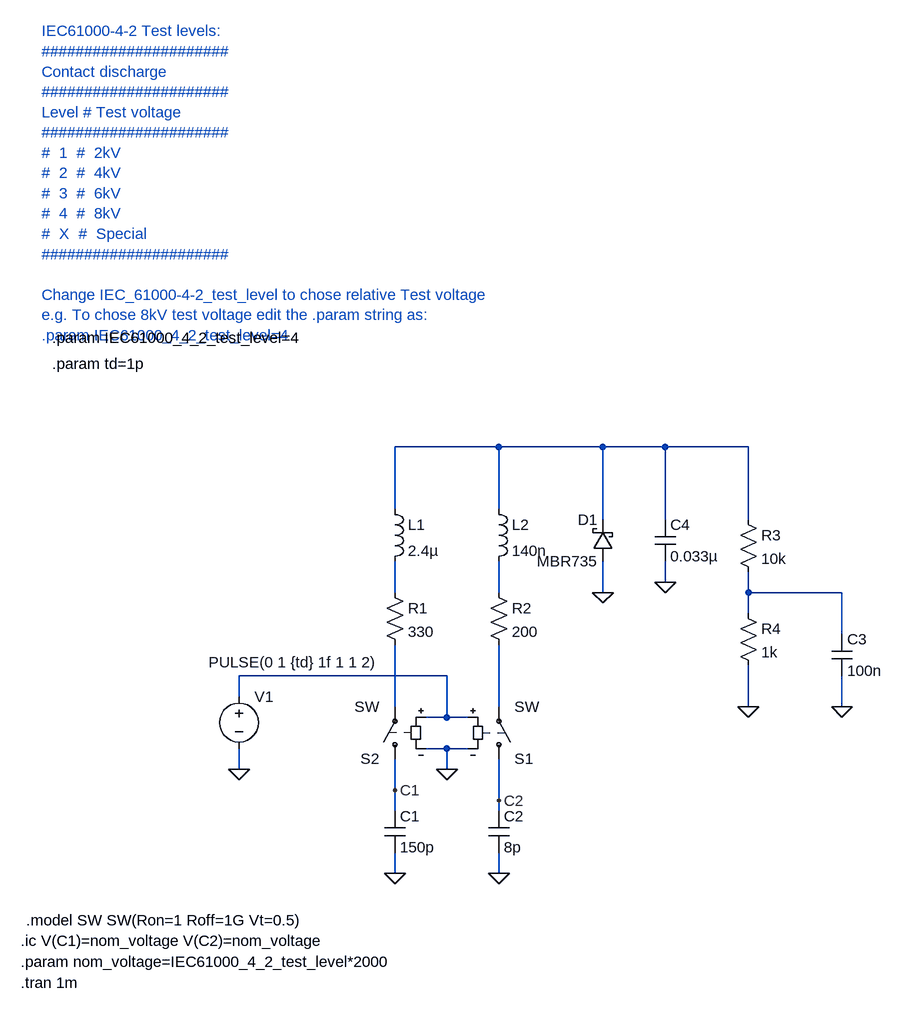
[diagram p0: schematic ISO61000-4-2.asc]
ISO61000-4-2.asc, the LTspice schematic file:
Version 4
SHEET 1 1932 840
WIRE 224 -16 64 -16
WIRE 384 -16 224 -16
WIRE 480 -16 384 -16
WIRE 608 -16 480 -16
WIRE 64 80 64 -16
WIRE 224 80 224 -16
WIRE 384 96 384 -16
WIRE 480 96 480 -16
WIRE 608 96 608 -16
WIRE 480 192 480 160
WIRE 64 208 64 160
WIRE 224 208 224 160
WIRE 384 208 384 160
WIRE 608 208 608 176
WIRE 752 208 608 208
WIRE 608 240 608 208
WIRE 752 272 752 208
WIRE 144 336 -176 336
WIRE -176 368 -176 336
WIRE 64 384 64 288
WIRE 224 384 224 288
WIRE 608 384 608 320
WIRE 752 384 752 336
WIRE 144 400 144 336
WIRE 144 400 112 400
WIRE 176 400 144 400
WIRE 144 448 112 448
WIRE 176 448 144 448
WIRE -176 480 -176 448
WIRE 144 480 144 448
WIRE 64 512 64 464
WIRE 224 528 224 464
WIRE 64 544 64 512
WIRE 224 544 224 528
WIRE 64 640 64 608
WIRE 224 640 224 608
FLAG 144 480 0
FLAG 64 640 0
FLAG 224 640 0
FLAG -176 480 0
FLAG 608 384 0
FLAG 64 512 C1
FLAG 224 528 C2
FLAG 752 384 0
FLAG 480 192 0
FLAG 384 208 0
SYMBOL ind 48 64 R0
SYMATTR InstName L1
SYMATTR Value 2.4µ
SYMBOL ind 208 64 R0
SYMATTR InstName L2
SYMATTR Value 140n
SYMBOL res 48 192 R0
SYMATTR InstName R1
SYMATTR Value 330
SYMBOL res 208 192 R0
SYMATTR InstName R2
SYMATTR Value 200
SYMBOL sw 224 480 M180
SYMATTR InstName S1
SYMBOL sw 64 480 R180
SYMATTR InstName S2
SYMBOL cap 48 544 R0
SYMATTR InstName C1
SYMATTR Value 150p
SYMBOL cap 208 544 R0
SYMATTR InstName C2
SYMATTR Value 8p
SYMBOL voltage -176 352 R0
WINDOW 123 0 0 Left 0
WINDOW 39 0 0 Left 0
WINDOW 3 -47 -37 Left 2
SYMATTR Value PULSE(0 1 {td} 1f 1 1 2)
SYMATTR InstName V1
SYMBOL res 592 80 R0
SYMATTR InstName R3
SYMATTR Value 10k
SYMBOL res 592 224 R0
SYMATTR InstName R4
SYMATTR Value 1k
SYMBOL cap 736 272 R0
SYMATTR InstName C3
SYMATTR Value 100n
SYMBOL cap 464 96 R0
SYMATTR InstName C4
SYMATTR Value 0.033µ
SYMATTR SpiceLine V=50 Irms=0 Rser=0 Lser=0 mfg="Murata" pn="GCM155R71H333KE02" type="X7R"
SYMBOL schottky 400 160 R180
WINDOW 0 24 64 Left 2
WINDOW 3 24 0 Left 2
SYMATTR InstName D1
SYMATTR Value MBR735
SYMATTR Description Diode
SYMATTR Type diode
TEXT -504 712 Left 2 !.model SW SW(Ron=1 Roff=1G Vt=0.5)
TEXT -512 744 Left 2 !.ic V(C1)=nom_voltage V(C2)=nom_voltage
TEXT -512 776 Left 2 !.param nom_voltage=IEC61000_4_2_test_level*2000
TEXT -480 -656 Left 2 ;IEC61000-4-2 Test levels:\n######################\nContact discharge\n######################\nLevel # Test voltage\n######################\n#  1  #  2kV\n#  2  #  4kV\n#  3  #  6kV\n#  4  #  8kV\n#  X  #  Special\n######################\n \nChange IEC_61000-4-2_test_level to chose relative Test voltage\ne.g. To chose 8kV test voltage edit the .param string as:\n.param IEC61000_4_2_test_level=4
TEXT -512 808 Left 2 !.tran 1m
TEXT -464 -184 Left 2 !.param IEC61000_4_2_test_level=4
TEXT -464 -144 Left 2 !.param td=1p

The netlist it stands for:
* ISO61000-4-2.asc
L1 N001 N002 2.4µ
L2 N001 N003 140n
R1 N002 N006 330
R2 N003 N007 200
S1 C2 N007 N005 0 SW
S2 C1 N006 N005 0 SW
C1 C1 0 150p
C2 C2 0 8p
V1 N005 0 PULSE(0 1 {td} 1f 1 1 2)
R3 N001 N004 10k
R4 N004 0 1k
C3 N004 0 100n
C4 N001 0 0.033µ V=50 Irms=0 Rser=0 Lser=0 mfg="Murata" pn="GCM155R71H333KE02" type="X7R"
D1 0 N001 MBR735
.model D D
.lib standard.dio
.model SW SW(Ron=1 Roff=1G Vt=0.5)
.ic V(C1)=nom_voltage V(C2)=nom_voltage
.param nom_voltage=IEC61000_4_2_test_level*2000
* IEC61000-4-2 Test levels:
* ######################
* Contact discharge
* ######################
* Level # Test voltage
* ######################
* #  1  #  2kV
* #  2  #  4kV
* #  3  #  6kV
* #  4  #  8kV
* #  X  #  Special
* ######################
* Change IEC_61000-4-2_test_level to chose relative Test voltage
* e.g. To chose 8kV test voltage edit the .param string as:
* .param IEC61000_4_2_test_level=4
.tran 1m
.param IEC61000_4_2_test_level=4
.param td=1p
.backanno
.end

* Results of the author's LTspice run, read from the files saved beside the schematic
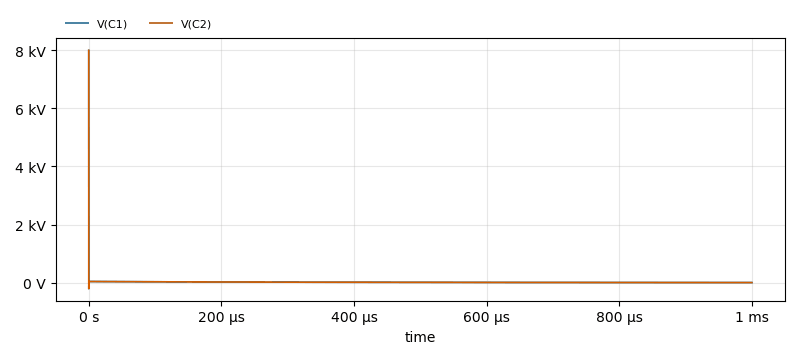
[diagram p1: Transient Analysis of ISO61000-4-2.asc, plotted from the saved traces]
* Transient Analysis, 1 run:
*   V(C1): min 977.7 mV, max 8 kV, average 12.2 V, rms 45.7 V, last 977.7 mV
*   V(C2): min -213.2 V, max 8 kV, average 11.81 V, rms 17.69 V, last 977.3 mV